# Altium schematic sheet 01 - CC2650.SchDoc: CC2650 MCU and BLE Radio
size A3; DrawnBy: LS, OB, AB, AG, IM; Organization: Miromico, ETHZ; Revision: 3; SheetNumber: 2; SheetTotal: 4; SchemaTitle: CC2650 MCU and BLE Radio
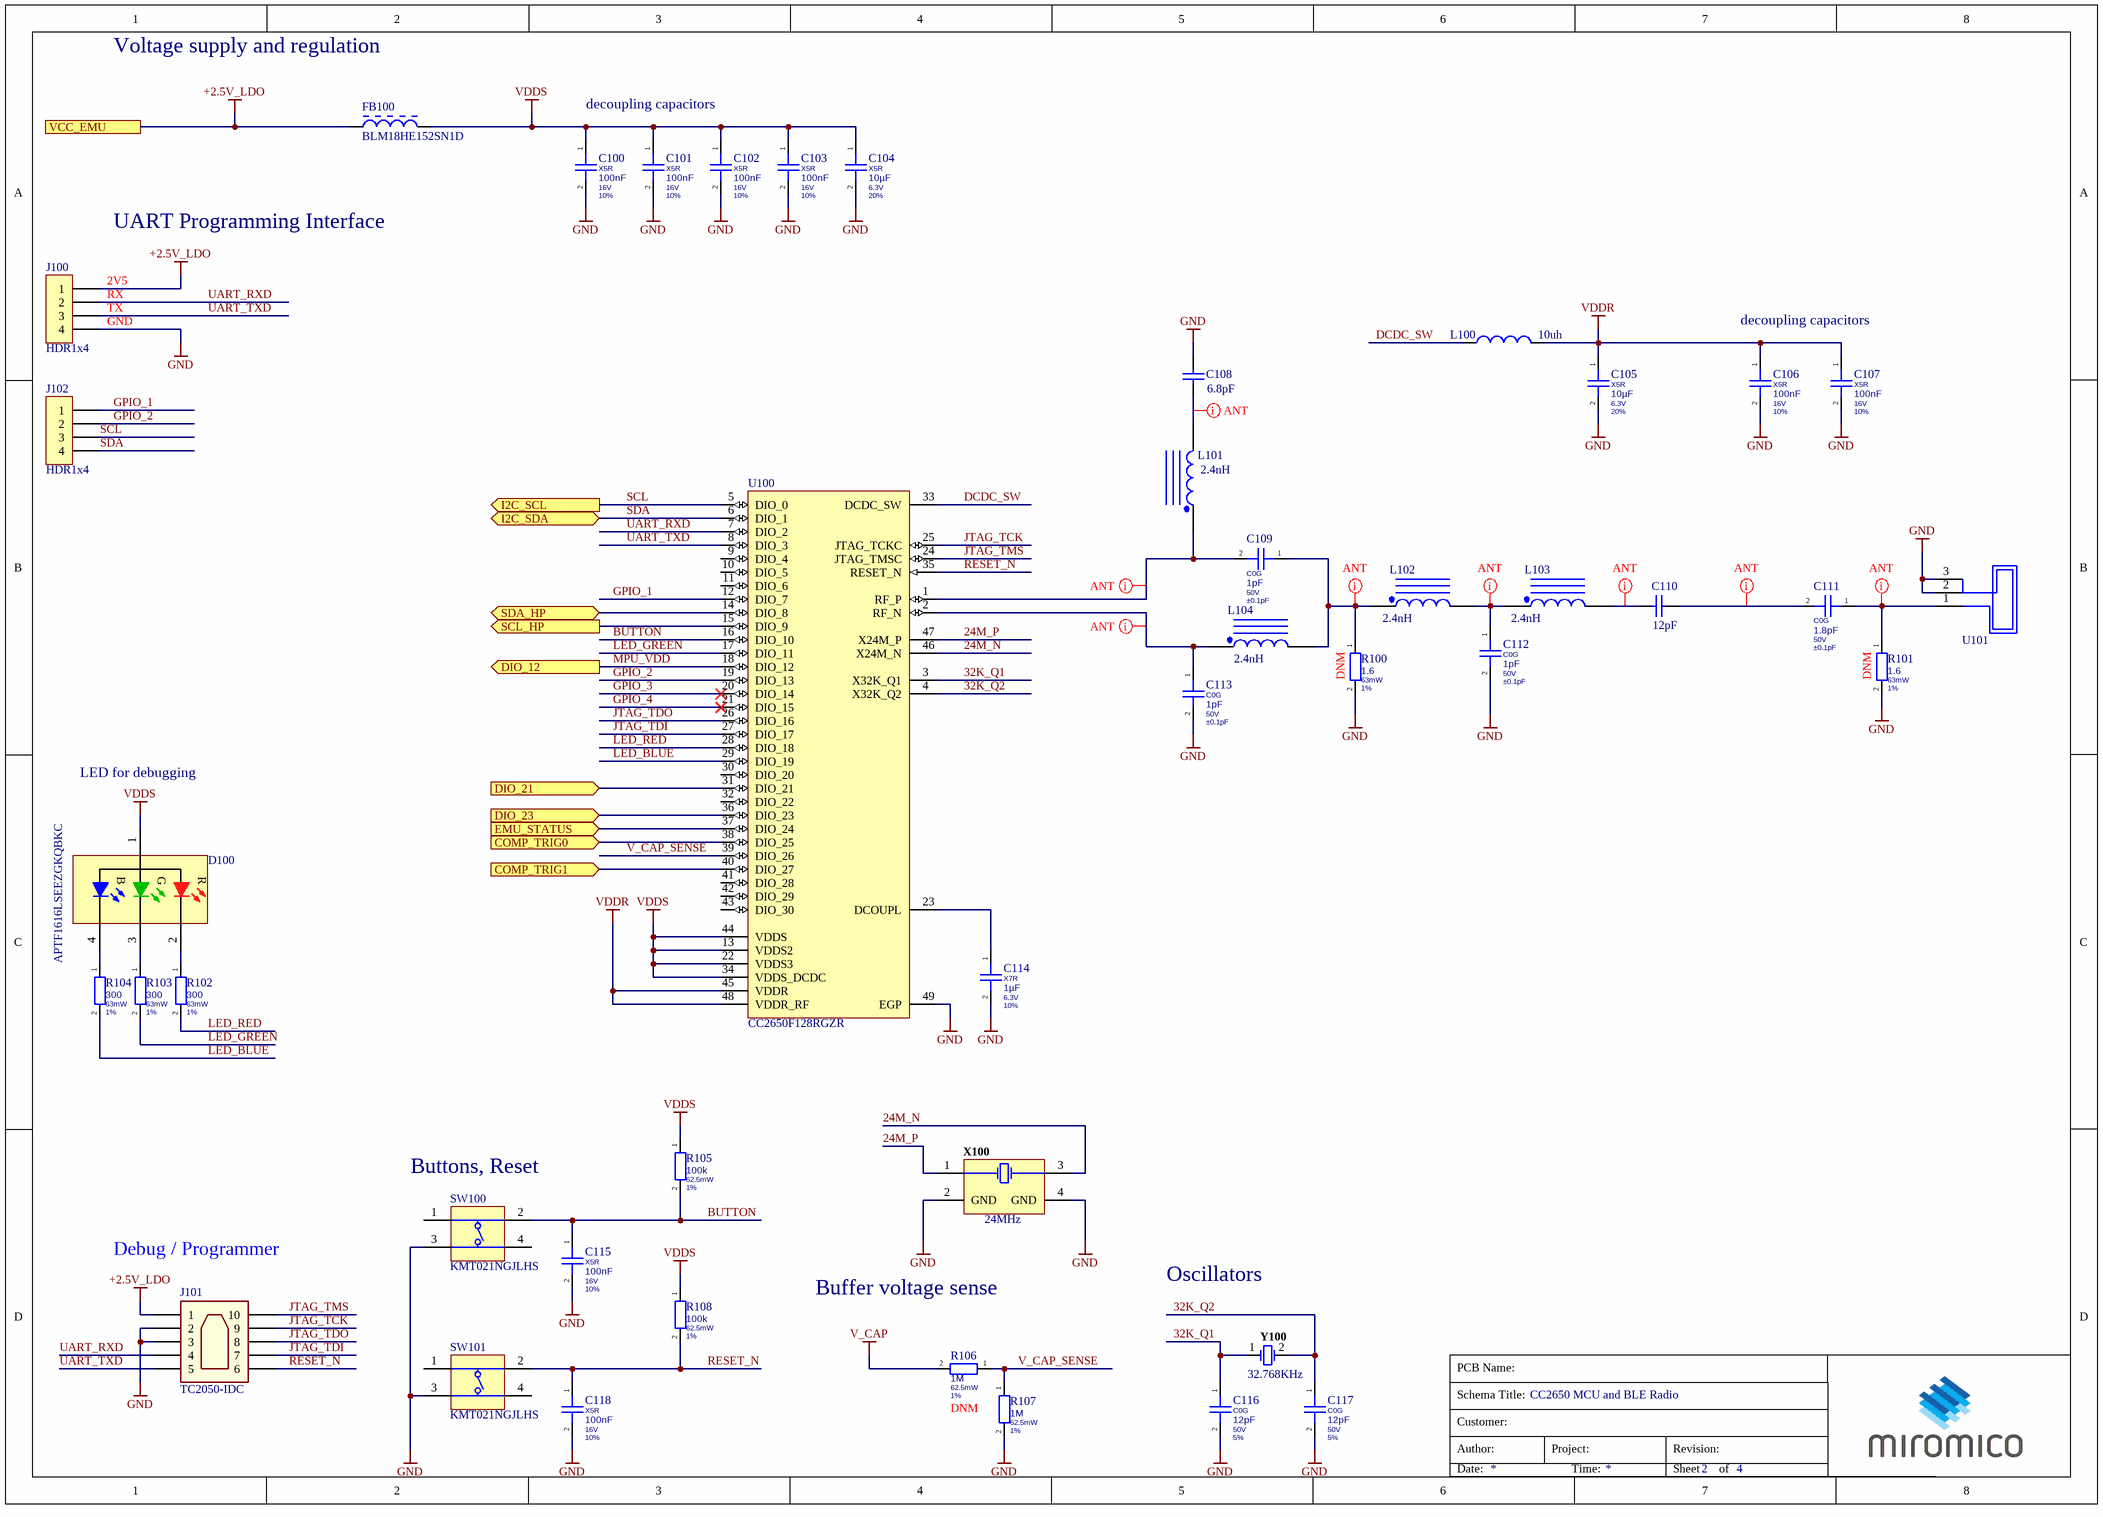
[diagram p0: 01 - CC2650.SchDoc]

## Parts
C100  Dielectric: X5R  Capacitance: 100nF  Voltage Rating: 16V  Tolerance: 10%  [CAPC0402(1005)60_L]  (hidden comment: GRM155R61C104KA88D)
C101  Dielectric: X5R  Capacitance: 100nF  Voltage Rating: 16V  Tolerance: 10%  [CAPC0402(1005)60_L]  (hidden comment: GRM155R61C104KA88D)
C102  Dielectric: X5R  Capacitance: 100nF  Voltage Rating: 16V  Tolerance: 10%  [CAPC0402(1005)60_L]  (hidden comment: GRM155R61C104KA88D)
C103  Dielectric: X5R  Capacitance: 100nF  Voltage Rating: 16V  Tolerance: 10%  [CAPC0402(1005)60_L]  (hidden comment: GRM155R61C104KA88D)
C104  Dielectric: X5R  Capacitance: 10µF  Voltage Rating: 6.3V  Tolerance: 20%  [CAPC0402(1005)60_L]  (hidden comment: GRJ155R60J106ME11D)
C105  Dielectric: X5R  Capacitance: 10µF  Voltage Rating: 6.3V  Tolerance: 20%  [CAPC0402(1005)60_L]  (hidden comment: GRJ155R60J106ME11D)
C106  Dielectric: X5R  Capacitance: 100nF  Voltage Rating: 16V  Tolerance: 10%  [CAPC0402(1005)60_L]  (hidden comment: GRM155R61C104KA88D)
C107  Dielectric: X5R  Capacitance: 100nF  Voltage Rating: 16V  Tolerance: 10%  [CAPC0402(1005)60_L]  (hidden comment: GRM155R61C104KA88D)
C108  value 6.8pF  [CAPC0402(1005)60_L]  (hidden comment: CAP 6.8pF 10V 0402(1005))
C109  Dielectric: C0G  Capacitance: 1pF  Voltage Rating: 50V  Tolerance: ±0.1pF  [CAPC0402(1005)60_L]  (hidden comment: GRM1555C1H1R0BA01D)
C110  value 12pF  [CAPC0402(1005)60_L]  (hidden comment: CAP 12pF 10V 0402(1005))
C111  Dielectric: C0G  Capacitance: 1.8pF  Voltage Rating: 50V  Tolerance: ±0.1pF  [CAPC0402(1005)60_L]  (hidden comment: GRM1555C1H1R8BA01D)
C112  Dielectric: C0G  Capacitance: 1pF  Voltage Rating: 50V  Tolerance: ±0.1pF  [CAPC0402(1005)60_L]  (hidden comment: GRM1555C1H1R0BA01D)
C113  Dielectric: C0G  Capacitance: 1pF  Voltage Rating: 50V  Tolerance: ±0.1pF  [CAPC0402(1005)60_L]  (hidden comment: GRM1555C1H1R0BA01D)
C114  Dielectric: X7R  Capacitance: 1µF  Voltage Rating: 6.3V  Tolerance: 10%  [CAPC0402(1005)60_L]  (hidden comment: GRM155R70J105KA12J)
C115  Dielectric: X5R  Capacitance: 100nF  Voltage Rating: 16V  Tolerance: 10%  [CAPC0402(1005)60_L]  (hidden comment: GRM155R61C104KA88D)
C116  Dielectric: C0G  Capacitance: 12pF  Voltage Rating: 50V  Tolerance: 5%  [CAPC0402(1005)60_L]  (hidden comment: GRM1555C1H120JA01D)
C117  Dielectric: C0G  Capacitance: 12pF  Voltage Rating: 50V  Tolerance: 5%  [CAPC0402(1005)60_L]  (hidden comment: GRM1555C1H120JA01D)
C118  Dielectric: X5R  Capacitance: 100nF  Voltage Rating: 16V  Tolerance: 10%  [CAPC0402(1005)60_L]  (hidden comment: GRM155R61C104KA88D)
D100  APTF1616LSEEZGKQBKC  [APTF1616LSEEZGKQBKC]
FB100  BLM18HE152SN1D  [MURA-BLM18-RF-H4-CHIP-2_V]
J100  HDR1x4  [HDR1x4]  (no BOM)
J101  TC2050-IDC  [TC2050-IDC-NL-10]  (no BOM)
J102  HDR1x4  [HDR1x4]  (no BOM)
L100  Inductance: 10uh  [INDC0805(2012)X11_L]  (hidden comment: CKS2125100M-T)
L101  Inductance: 2.4nH  [INDC1005X55X25LL05T10_A]  (hidden comment: LQG15HS2N4S02D)
L102  Inductance: 2.4nH  [INDC1005X55X25LL05T10_A]  (hidden comment: LQG15HS2N4S02D)
L103  Inductance: 2.4nH  [INDC1005X55X25LL05T10_A]  (hidden comment: LQG15HS2N4S02D)
L104  Inductance: 2.4nH  [INDC1005X55X25LL05T10_A]  (hidden comment: LQG15HS2N4S02D)
R100  Resistance: 1.6  Power Rating: 63mW  Tolerance: 1%  [RESC0402(1005)_L]  (hidden comment: CRCW04021R60FKED)
R101  Resistance: 1.6  Power Rating: 63mW  Tolerance: 1%  [RESC0402(1005)_L]  (hidden comment: CRCW04021R60FKED)
R102  Resistance: 300  Power Rating: 63mW  Tolerance: 1%  [RESC0402(1005)_L]  (hidden comment: RMCF0402FT300R)
R103  Resistance: 300  Power Rating: 63mW  Tolerance: 1%  [RESC0402(1005)_L]  (hidden comment: RMCF0402FT300R)
R104  Resistance: 300  Power Rating: 63mW  Tolerance: 1%  [RESC0402(1005)_L]  (hidden comment: RMCF0402FT300R)
R105  Resistance: 100k  Power Rating: 62.5mW  Tolerance: 1%  [RESC0402(1005)_L]  (hidden comment: RMCF0402FT100K)
R106  Resistance: 1M  Power Rating: 62.5mW  Tolerance: 1%  [RESC0402(1005)_L]  (hidden comment: RMCF0402FT1M00)
R107  Resistance: 1M  Power Rating: 62.5mW  Tolerance: 1%  [RESC0402(1005)_L]  (hidden comment: RMCF0402FT1M00)
R108  Resistance: 100k  Power Rating: 62.5mW  Tolerance: 1%  [RESC0402(1005)_L]  (hidden comment: RMCF0402FT100K)
SW100  KMT021NGJLHS  [KMT021NGJLHS-Footprint-1]
SW101  KMT021NGJLHS  [KMT021NGJLHS-Footprint-1]
U100  CC2650F128RGZR  [RGZ0048A_V]
U101  Antenna Patch  [2.4GHz Inverted F Antenna]  (value not drawn)  (net tie, no BOM)
X100  Frequency: 24MHz  [EPSON-TSX-3225_V]  (hidden comment: TSX-3225 24.0000MF15X-AC3)
Y100  Frequency: 32.768KHz  [ABRA-ABS07_A_V]  (hidden comment: ABS07-120-32.768KHZ-T)

## Ports
COMP_TRIG0 (in), COMP_TRIG1 (in), DIO_12 (out), DIO_21 (in), DIO_23 (in), EMU_STATUS (in), I2C_SCL (out), I2C_SDA (bidir), SCL_HP (out), SDA_HP (bidir), VCC_EMU

## Nets
+2.5V_LDO: FB100.1 J100.1 J101.1 ; port VCC_EMU
GND: C100.2 C101.2 C102.2 C103.2 C104.2 C105.2 C106.2 C107.2 C108.2 C112.2 C113.2 C114.2 C115.2 C116.2 C117.2 C118.2 J100.4 J101.2 J101.3 R100.2 R101.2 R107.2 SW100.3(T3) SW101.3(T3) U100.49(EGP) U101.2 U101.3 X100.2(GND) X100.4(GND)
V_CAP: R106.2
VDDR: C105.1 C106.1 C107.1 L100.2 U100.45(VDDR) U100.48(VDDR_RF)
VDDS: C100.1 C101.1 C102.1 C103.1 C104.1 D100.1 FB100.2 R105.1 R108.1 U100.13(VDDS2) U100.22(VDDS3) U100.34(VDDS_DCDC) U100.44(VDDS)
24M_N: U100.46(X24M_N) X100.3(X2)
24M_P: U100.47(X24M_P) X100.1(X1)
32K_Q1: C116.1 U100.3(X32K_Q1) Y100.1
32K_Q2: C117.1 U100.4(X32K_Q2) Y100.2
BUTTON: C115.1 R105.2 SW100.2(T2) U100.16(DIO_10)
COMP_TRIG0: U100.38(DIO_25) ; port COMP_TRIG0
COMP_TRIG1: U100.40(DIO_27) ; port COMP_TRIG1
DCDC_SW: L100.1 U100.33(DCDC_SW)
DIO_21: U100.31(DIO_21) ; port DIO_21
DIO_23: U100.36(DIO_23) ; port DIO_23
EMU_STATUS: U100.37(DIO_24) ; port EMU_STATUS
GPIO_1: J102.1 U100.12(DIO_7)
GPIO_2: J102.2 U100.19(DIO_13)
GPIO_3: U100.20(DIO_14)
GPIO_4: U100.21(DIO_15)
JTAG_TCK: J101.9 U100.25(JTAG_TCKC)
JTAG_TDI: J101.7 U100.27(DIO_17)
JTAG_TDO: J101.8 U100.26(DIO_16)
JTAG_TMS: J101.10 U100.24(JTAG_TMSC)
LED_BLUE: R104.2 U100.29(DIO_19)
LED_GREEN: R103.2 U100.17(DIO_11)
LED_RED: R102.2 U100.28(DIO_18)
MPU_VDD: U100.18(DIO_12) ; port DIO_12
RESET_N: C118.1 J101.6 R108.2 SW101.2(T2) U100.35(RESET_N)
SCL: J102.3 U100.5(DIO_0) ; port I2C_SCL
SCL_HP: U100.15(DIO_9) ; port SCL_HP
SDA: J102.4 U100.6(DIO_1) ; port I2C_SDA
SDA_HP: U100.14(DIO_8) ; port SDA_HP
UART_RXD: J100.2 J101.4 U100.7(DIO_2)
UART_TXD: J100.3 J101.5 U100.8(DIO_3)
V_CAP_SENSE: R106.1 R107.1 U100.39(DIO_26)
NetC108_1: C108.1 L101.2
NetC109_1: C109.1 L102.1 L104.2 R100.1
NetC109_2: C109.2 L101.1 U100.1(RF_P)
NetC110_1: C110.1 L103.2
NetC110_2: C110.2 C111.2
NetC111_1: C111.1 R101.1 U101.1
NetC112_1: C112.1 L102.2 L103.1
NetC113_1: C113.1 L104.1 U100.2(RF_N)
NetC114_1: C114.1 U100.23(DCOUPL)
NetD100_2: D100.2(R) R102.1
NetD100_3: D100.3(G) R103.1
NetD100_4: D100.4(B) R104.1

Not connected (* = marked no-connect by the designer): SW100 1(T1) 4(T3); SW101 1(T1) 4(T3); U100 9(DIO_4) 10(DIO_5) 11(DIO_6) 30(DIO_20) 32(DIO_22) 41(DIO_28) 42(DIO_29) 43(DIO_30)

## Layout directives
net class ANT: NetC108_1, NetC109_1, NetC109_2, NetC110_1, NetC110_2, NetC111_1, NetC112_1, NetC113_1

## Notes on the sheet
- Voltage supply and regulation
- decoupling capacitors
- UART Programming Interface
- (near J100) 2V5
- (near J100) RX
- (near J100) TX
- (near J100) GND
- (near R100) DNM
- (near R101) DNM
- LED for debugging
- (near SW100) Buttons, Reset
- Debug / Programmer
- Buffer voltage sense
- Oscillators
- DNM
- Schema Title:
- PCB Name:
- Author:
- Customer:
- Project:
- Revision:
- Date:
- Time:
- Sheet
- of

## Library data of the parts
C100-C103 C106 C107 C115 C118 = CMP-00416-01: 0.1µF ±10% 16V Ceramic Capacitor X5R 0402 (1005 Metric); Manufacturer: Murata Electronics; ComponentLink1Description: Datasheet; Manufacturer Part Number: GRM155R61C104KA88D; Supplier 1: Digi-Key; Supplier Part Number 1: 490-5415-1-ND; Mount: Surface Mount; Case/Package: 0402; Case Code (Metric): 1005; Case Code (Imperial): 0402; Min Operating Temperature: -55°C; Max Operating Temperature: 85°C; Package Quantity: 1; Packaging: Tape and Reel; Termination: SMD/SMT; Voltage: 16V; Voltage Rating (DC): 16V; Length: 1mm; Width: 0.02inch; Height: 0.5mm; Thickness: 0.022inch; Depth: 0.5mm; Radiation Hardening: No; REACH SVHC: No SVHC; Lead Free: Lead Free
C104 C105 = CMP-00462-01: 10µF ±20% 6.3V Ceramic Capacitor X5R 0402 (1005 Metric); Manufacturer: Murata Electronics; ComponentLink1Description: Datasheet; Manufacturer Part Number: GRJ155R60J106ME11D; Supplier 1: Digi-Key; Supplier Part Number 1: 490-13211-1-ND; Mount: Surface Mount; Case/Package: 0402; Case Code (Metric): 1005; Case Code (Imperial): 0402; Min Operating Temperature: -55°C; Max Operating Temperature: 85°C; Packaging: Cut Tape; Features: Soft Termination; Length: 0.039inch; Width: 0.02inch; Thickness: 0.028inch
C108 = CMP-1034-00503-1: CAP 6.8pF 10V ±5% 0402 (1005 Metric) Thickness 0.6mm SMD; Case-EIA: 0402; Case-Metric: 1005; Tolerance: Â±5%; Technology: SMT; Rated Voltage: 10 V; Max Thickness: 0.6 mm
C109 C112 C113 = CMP-00426-01: 1pF ±0.1pF 50V Ceramic Capacitor C0G, NP0 0402 (1005 Metric); Manufacturer: Murata Electronics; Temperature Coefficient: 30ppm/°C; ComponentLink1Description: Datasheet; Manufacturer Part Number: GRM1555C1H1R0BA01D; Supplier 1: Digi-Key; Supplier Part Number 1: 490-6206-1-ND; Mount: Surface Mount; Case/Package: 0402; Case Code (Metric): 1005; Case Code (Imperial): 0402; Material: Ceramic; Min Operating Temperature: -55°C; Max Operating Temperature: 125°C; Packaging: Tape and Reel; Package Quantity: 10000; Voltage Rating (DC): 50V; Termination: SMD/SMT; Voltage: 50V; Length: 1mm; Width: 0.5mm; Height: 0.5mm; Thickness: 0.022inch; Depth: 0.5mm; Radiation Hardening: No; REACH SVHC: No SVHC; Lead Free: Lead Free
C110 = CMP-1034-00750-1: CAP 12pF 10V ±2% 0402 (1005 Metric) Thickness 0.6mm SMD; Tolerance: Â±2%; Case-EIA: 0402; Case-Metric: 1005; Max Thickness: 0.6 mm; Rated Voltage: 10 V; Technology: SMT
C111 = CMP-00424-01: 1.8pF ±0.1pF 50V Ceramic Capacitor C0G, NP0 0402 (1005 Metric); Manufacturer: Murata Electronics; Temperature Coefficient: 30ppm/°C; Supplier 1: Digi-Key; Supplier Part Number 1: 490-6215-1-ND; Mount: Surface Mount; Case/Package: 0402; Case Code (Metric): 1005; Case Code (Imperial): 0402; Material: Ceramic; Min Operating Temperature: -55°C; Max Operating Temperature: 125°C; Packaging: Tape and Reel; Package Quantity: 10000; Termination: SMD/SMT; Voltage: 50V; Voltage Rating (DC): 50V; Length: 1mm; Width: 0.02inch; Height: 0.5mm; Thickness: 0.022inch; Depth: 0.5mm; Radiation Hardening: No; REACH SVHC: Unknown; Lead Free: Lead Free; ComponentLink1Description: Datasheet; Manufacturer Part Number: GRM1555C1H1R8BA01D
C114 = CMP-00441-03: 1µF ±10% 6.3V Ceramic Capacitor X7R 0402 (1005 Metric); Manufacturer: Murata Electronics; ComponentLink1Description: Datasheet; Manufacturer Part Number: GRM155R70J105KA12J; Supplier 1: Digi-Key; Supplier Part Number 1: 490-13339-1-ND; Mount: Surface Mount; Case/Package: 0402; Case Code (Metric): 1005; Case Code (Imperial): 0402; Weight: 0.000212oz; Min Operating Temperature: -55°C; Max Operating Temperature: 125°C; Packaging: Tape and Reel; Termination: SMD/SMT; Voltage Rating (DC): 6.3V; Package Quantity: 50000; Length: 0.039inch; Width: 0.02inch; Thickness: 0.022inch
C116 C117 = CMP-00428-01: 12pF ±5% 50V Ceramic Capacitor C0G, NP0 0402 (1005 Metric); Manufacturer: Murata Electronics; Temperature Coefficient: 30ppm/°C; ComponentLink1Description: Datasheet; Manufacturer Part Number: GRM1555C1H120JA01D; Supplier 1: Digi-Key; Supplier Part Number 1: 490-5924-1-ND; Mount: Surface Mount; Case/Package: 0402; Number of Pins: 2; Case Code (Imperial): 0402; Case Code (Metric): 1005; Material: Ceramic; Min Operating Temperature: -55°C; Max Operating Temperature: 125°C; Packaging: Tape and Reel; Voltage Rating (DC): 50V; Package Quantity: 10000; Termination: SMD/SMT; Voltage: 50V; Length: 1mm; Width: 0.5mm; Height: 0.5mm; Thickness: 0.022inch; Depth: 0.5mm; Radiation Hardening: No; REACH SVHC: No SVHC; Lead Free: Lead Free
D100 = CMP-00017-A.6: HELI Colour; 1.6X1.6MM LOW CURRENT RGB SMD LED; Manufacturer: Kingbright; Colour: Blue,Green,Red; Lens Colour: Colorless; Lens Transparency: Clear; Luminous Intensity: 14mcd; Test Current: 2mA; Viewing Angle: 120°; Dominant Wavelength: 465nm; Forward Voltage: 2.7V; Properties: Red, Green, Blue (RGB) 621nm Red, 525nm Green, 465nm Blue LED Indication - Discrete 1.8V Red, 2.7V Green, 2.7V Blue 0606 (1616 Metric); Case Code (Metric): 1616; Case Code (Imperial): 0606; Packaging: Tape and Reel; Case/Package: 0606; Length: 1.6mm; Height: 0.9mm; Width: 1.6mm; Manufacturer Part Number: APTF1616LSEEZGKQBKC; Supplier 1: Digi-Key; Supplier Part Number 1: 754-1972-1-ND; ComponentLink1Description: 3447e5e9f92dce591761be9cb3680f3b.pdf; ComponentLink1URL: http://www.alliedelec.com/m/d/3447e5e9f92dce591761be9cb3680f3b.pdf; Category: LED
FB100 = CMP-0686-00368-2: Chip Ferrite Bead for GHz Band High-speed Signal Lines, 1500 Ohm, 500 mA, -55 to 125 degC, 1.6 x 0.8 x 0.95 mm SMD, Tape and Reel; Manufacturer: Murata; Rated Current: 500 mA; Impedance (at 100 MHz): 1500 Ohm +/- 25%; DC Resistance: 0.50 Ohm Max.; Packing: Tape and Reel; DatasheetVersion: 08/2013; ComponentLink1URL: http://www.murata.com/; Mounting Technology: Surface Mount; ComponentLink2URL: http://www.murata.com/products/catalog/pdf/c31e.pdf; ComponentLink3Description: Package Specification; ComponentLink2Description: Datasheet; PackageReference: BLM18_H950-2; ComponentLink1Description: Manufacturer URL; PackageDescription: 2-Pin Chip, Body 1.6 x 0.8 mm; ComponentLink3URL: http://www.murata.com/products/catalog/pdf/c31e.pdf; PartNumber: BLM18HE152SN1D; Operating Temperature Range: -55 to 125 degC
J100 J102 = HDR1x4-01: 1x4 Pin Header, 2.54mm; Properties: 1x4 Pin Terminal Header, 2.54mm; SchLibComponentName: HDR1x4
J101 = TDC2050-IDC-03: TDC2050-IDC, 10Pins, dual footprint (leg and no-legs); Manufacturer: Tag-Connect; SchLibComponentName: TC2050-IDC; ComponentLink1Description: Datasheet; ComponentLink1URL: http://www.tag-connect.com/Materials/TC2050-IDC%20Datasheet.pdf; Manufacturer Part Number: TC2050-IDC
L100 = CMP-00871-1: FIXED IND 10UH 110MA 520 MOHM; Core Material: Ferrite; Tolerance: 20%; Shielding: Unshielded; Self Resonant Frequency: 24MHz; DC Resistance (DCR): 520mR; Test Frequency: 2MHz; Mount: Surface Mount; Case/Package: 0805; Case Code (Metric): 2012; Case Code (Imperial): 0805; Min Operating Temperature: -40°C; Max Operating Temperature: 85°C; Package Quantity: 2000; Current Rating: 110mA; Packaging: Tape and Reel; Inductance Tolerance: 20%; Max DC Current: 110mA; Termination: SMD/SMT; DC Current: 110mA; Military Standard: Not; Length: 2mm; Height: 1.25mm; Width: 0.049inch; Height - Seated (Max): 0.057inch; Depth: 1.45mm; Radiation Hardening: No; REACH SVHC: Unknown; Lead Free: Lead Free; Halogen Free: Halogen Free
L101-L104 = CMP-2000-06579-1: Chip Inductor, 2.4 nH, +/- 0.3 nH, 300 mA, -55 to 125 degC, 0402 (1005 Metric), RoHS, Tape and Reel; Manufacturer: MurataElectronics; Core Material: Air; Minimum Quality Factor: 8@100MHz; Tolerance: 0.3nH; Maximum DC Resistance: 150mOhm; Type: RFChip; Maximum DC Current: 300mA; Product Height: 0.55mm; Datasheet URL: http://search.murata.co.jp/Ceramy/image/img/PDF/ENG/L0075S0083LQG15HS.pdf; Mounting Technology: SurfaceMount; Package Reference: 0402; Package Description: 2-Pin Surface Mount Device, Body 1 x 0.5 mm; Category: InductorSurfaceMount; Manufacturer URL: http://www.murata.com/; Package/Case: 0402; Datasheet Version: 09/2010
R100 R101 = CMP-00467-01: 1.6 Ohms ±1% 0.063W, 1/16W Chip Resistor 0402 (1005 Metric) Automotive AEC-Q200 Thick Film; Manufacturer: Vishay Dale; Voltage Rating: 50V; Temperature Coefficient: 100ppm/°C; ComponentLink1Description: Datasheet; ComponentLink1URL: https://www.vishay.com/docs/20035/dcrcwe3.pdf; Manufacturer Part Number: CRCW04021R60FKED; Supplier 1: Digi-Key; Supplier Part Number 1: 541-1.60LLCT-ND; Case/Package: 0402; Weight: 2.3E-05oz; Case Code (Imperial): 0402; Case Code (Metric): 1005; Contact Plating: Tin; Min Operating Temperature: -55°C; Max Operating Temperature: 155°C; Packaging: Tape and Reel; Package Quantity: 10; Termination: SMD/SMT; Resistor Type: Thick Film; Number of Terminations: 2; Max Power Dissipation: 63mW; Features: Automotive AEC-Q200; Length: 0.039inch; Width: 0.5mm; Height: 0.016inch; Radiation Hardening: No; Lead Free: Lead Free
R102-R104 = CMP-00466-01: 300 Ohms ±1% 0,063W, 1/16W Chipwiderstand 0402 (1005 metrisch) AutomobilzulassungAEC-Q200 Dickschicht; Manufacturer: Stackpole Electronics Inc; Temperature Coefficient: 100ppm/°C; ComponentLink1Description: Datasheet; ComponentLink1URL: https://www.seielect.com/catalog/sei-rmcf_rmcp.pdf; Manufacturer Part Number: RMCF0402FT300R; Supplier 1: Digi-Key; Supplier Part Number 1: RMCF0402FT300RCT-ND; Mount: Surface Mount; Case/Package: 0402; Case Code (Metric): 1005; Case Code (Imperial): 0402; Contact Plating: Tin,Matte; Min Operating Temperature: -55°C; Max Operating Temperature: 155°C; Packaging: Tape and Reel; Package Quantity: 10000; Resistor Type: Thick Film; Number of Terminations: 2; Max Power Dissipation: 63mW; Features: Automotive AEC-Q200; Length: 0.039inch; Width: 0.02inch; Height: 0.016inch; Radiation Hardening: No; Lead Free: Lead Free
R105 R108 = CMP-00463-01: 100 kOhms ±1% 0,063W, 1/16W Chipwiderstand 0402 (1005 metrisch) AutomobilzulassungAEC-Q200 Dickschicht; Manufacturer: Stackpole Electronics Inc; Temperature Coefficient: 100ppm/°C; Max Power Dissipation: 63mW; ComponentLink1Description: Datasheet; ComponentLink1URL: https://www.seielect.com/catalog/sei-rmcf_rmcp.pdf; Manufacturer Part Number: RMCF0402FT100K; Supplier 1: Digi-Key; Supplier Part Number 1: RMCF0402FT100KCT-ND; Mount: Surface Mount; Case/Package: 0402; Case Code (Metric): 1005; Case Code (Imperial): 0402; Contact Plating: Tin,Matte; Min Operating Temperature: -55°C; Max Operating Temperature: 155°C; Packaging: Tape and Reel; Resistor Type: Thick Film; Number of Terminations: 2; Features: Automotive AEC-Q200; Length: 1mm; Width: 0.02inch; Height: 0.016inch; Depth: 0.5mm; Radiation Hardening: No; Military Standard: Not; Lead Free: Lead Free
R106 R107 = CMP-00464-01: 1 MOhms ±1% 0,063W, 1/16W Chipwiderstand 0402 (1005 metrisch) AutomobilzulassungAEC-Q200 Dickschicht; Manufacturer: Stackpole Electronics Inc; Max Power Dissipation: 63mW; Temperature Coefficient: 100ppm/°C; Manufacturer Part Number: RMCF0402FT1M00; Supplier 1: Digi-Key; Supplier Part Number 1: RMCF0402FT1M00CT-ND; Mount: Surface Mount; Case/Package: 0402; Case Code (Metric): 1005; Case Code (Imperial): 0402; Contact Plating: Tin,Matte; Min Operating Temperature: -55°C; Max Operating Temperature: 155°C; Packaging: Tape and Reel; Resistor Type: Thick Film; Number of Terminations: 2; Features: Automotive AEC-Q200; Length: 1mm; Width: 0.02inch; Height: 0.016inch; Depth: 0.5mm; Radiation Hardening: No; Military Standard: Not; Lead Free: Lead Free; ComponentLink1Description: Datasheet; ComponentLink1URL: https://www.seielect.com/catalog/sei-rmcf_rmcp.pdf
SW100 SW101 = CMP-00503-02: Sensorschalter Ultra-LW Tact SW SMT SPNOFa 1.6N HF; Manufacturer: C&K; ComponentLink1Description: Datasheet; ComponentLink1URL: https://www.mouser.ch/datasheet/2/60/kmt0-1841444.pdf; Manufacturer Part Number: KMT021NGJLHS; Supplier 1: Mouser; Supplier Part Number 1: 611-KMT021NGJLHS
U100 = CMP-2000-06080-1: CC2650 SimpleLink(TM) Multistandard Wireless MCU, 1.8 to 3.8 V, -40 to 85 degC, 48-Pin VFQFN, Green (RoHS & no Sb/Br), Tape and Reel; Manufacturer: Texas Instruments; Minimum Operating Supply Voltage: 1.8V; Maximum Operating Supply Voltage: 3.8V; Maximum Speed: 48MHz; Lead Finish: GoldOverNickelPalladium; Screening Level: Industrial; Program Memory Size: 128KB; Max Processing Temp: 260; Operating Supply Voltage: 2.5; RAM Size: 30KB; Operating Temperature: -40to85C; Datasheet URL: http://www.ti.com/lit/ds/symlink/cc2650.pdf; Manufacturer URL: http://www.ti.com/; Datasheet Version: Rev. B, 07/2016; Category: MicrocontrollerTools; Package Description: 48-Pin Quad Flat No-lead Package, Body 7 x 7 mm, Pitch 0.5 mm; Package Reference: RGZ0048A; Mounting Technology: SurfaceMount; Mounting: SurfaceMount
U101 = CMP-00262-1: 2.4GHz Inverted F Antenna; Technology: SMT
X100 = CMP-2000-07333-1: MHz Range Crystal, 24 MHz, -40 to 85 degC, 4-Pin SMD, RoHS, Tape and Reel; Manufacturer: Epson; Brand: EpsonTiming; Frequency Stability: 10PPM; ESR: 40Ohms; Load Capacitance: 9pF; Unit Weight: 0.000564oz; Drive Level: 200uW; Datasheet Version: 12/2015; RoHS: True; Operating Temperature Range: -40Cto+85C; Length: 3.2mm; Tolerance: 10PPM; Width: 2.5mm; Mounting Technology: SurfaceMount; Package Description: 4-Pin Surface Mount Device, Body 3.2 x 2.5 mm; Manufacturer URL: https://www.eea.epson.com/; Factory Pack Quantity: 250; Package Reference: TSX-3225; Height: 0.6mm; Mounting Style: SMD/SMT; Termination Style: SMD/SMT; Datasheet URL: https://support.epson.biz/td/api/doc_check.php?dl=brief_FA-238V_en.pdf; Type: Crystal; Series: TSX-3225; Package / Case: 3.2mmx2.5mm; Product Category: Crystals; Packaging: Reel
Y100 = CMP-2000-07587-1: Tuning Fork Crystal, 32.768 KHz, +/- 20 ppm, -40 to 85 degC, 2-Pin SMD, RoHS, Tape and Reel; Manufacturer: Abracon; Case\/Package: SMD/SMT; Series Resistance: 60KOhm; Frequency Tolerance: 20ppm; Load Capacitance: 6pF; ESR (Equivalent Series Resistance): 55KOhm; Max Operating Temperature: 85degC; Width: 0.061inch; Radiation Hardening: No; Lead Free: LeadFree; RoHSCompliant: True; Depth: 1.5mm; Datasheet URL: http://www.abracon.com/Resonators/ABS07-120-32.768kHz-T.pdf; Termination: SMD/SMT; Manufacturer URL: http://www.abracon.com/; Package Quantity: 3000; Packaging: TapeandReel; Number of Pins: 2; Height: 0.035inch; Package Description: 2-Pin Surface Mount Device, Body 3.2 x 1.5 mm; Package Reference: ABS07; Mount: SurfaceMount; Tolerance: 20ppm; Mounting Technology: SurfaceMount; REACH SVHC: NoSVHC; Datasheet Version: 11/2014; Length: 3.2mm; Min Operating Temperature: -40degC